# EAGLE schematic backpower_eeprom_rpibout (EAGLE 8.0.1)
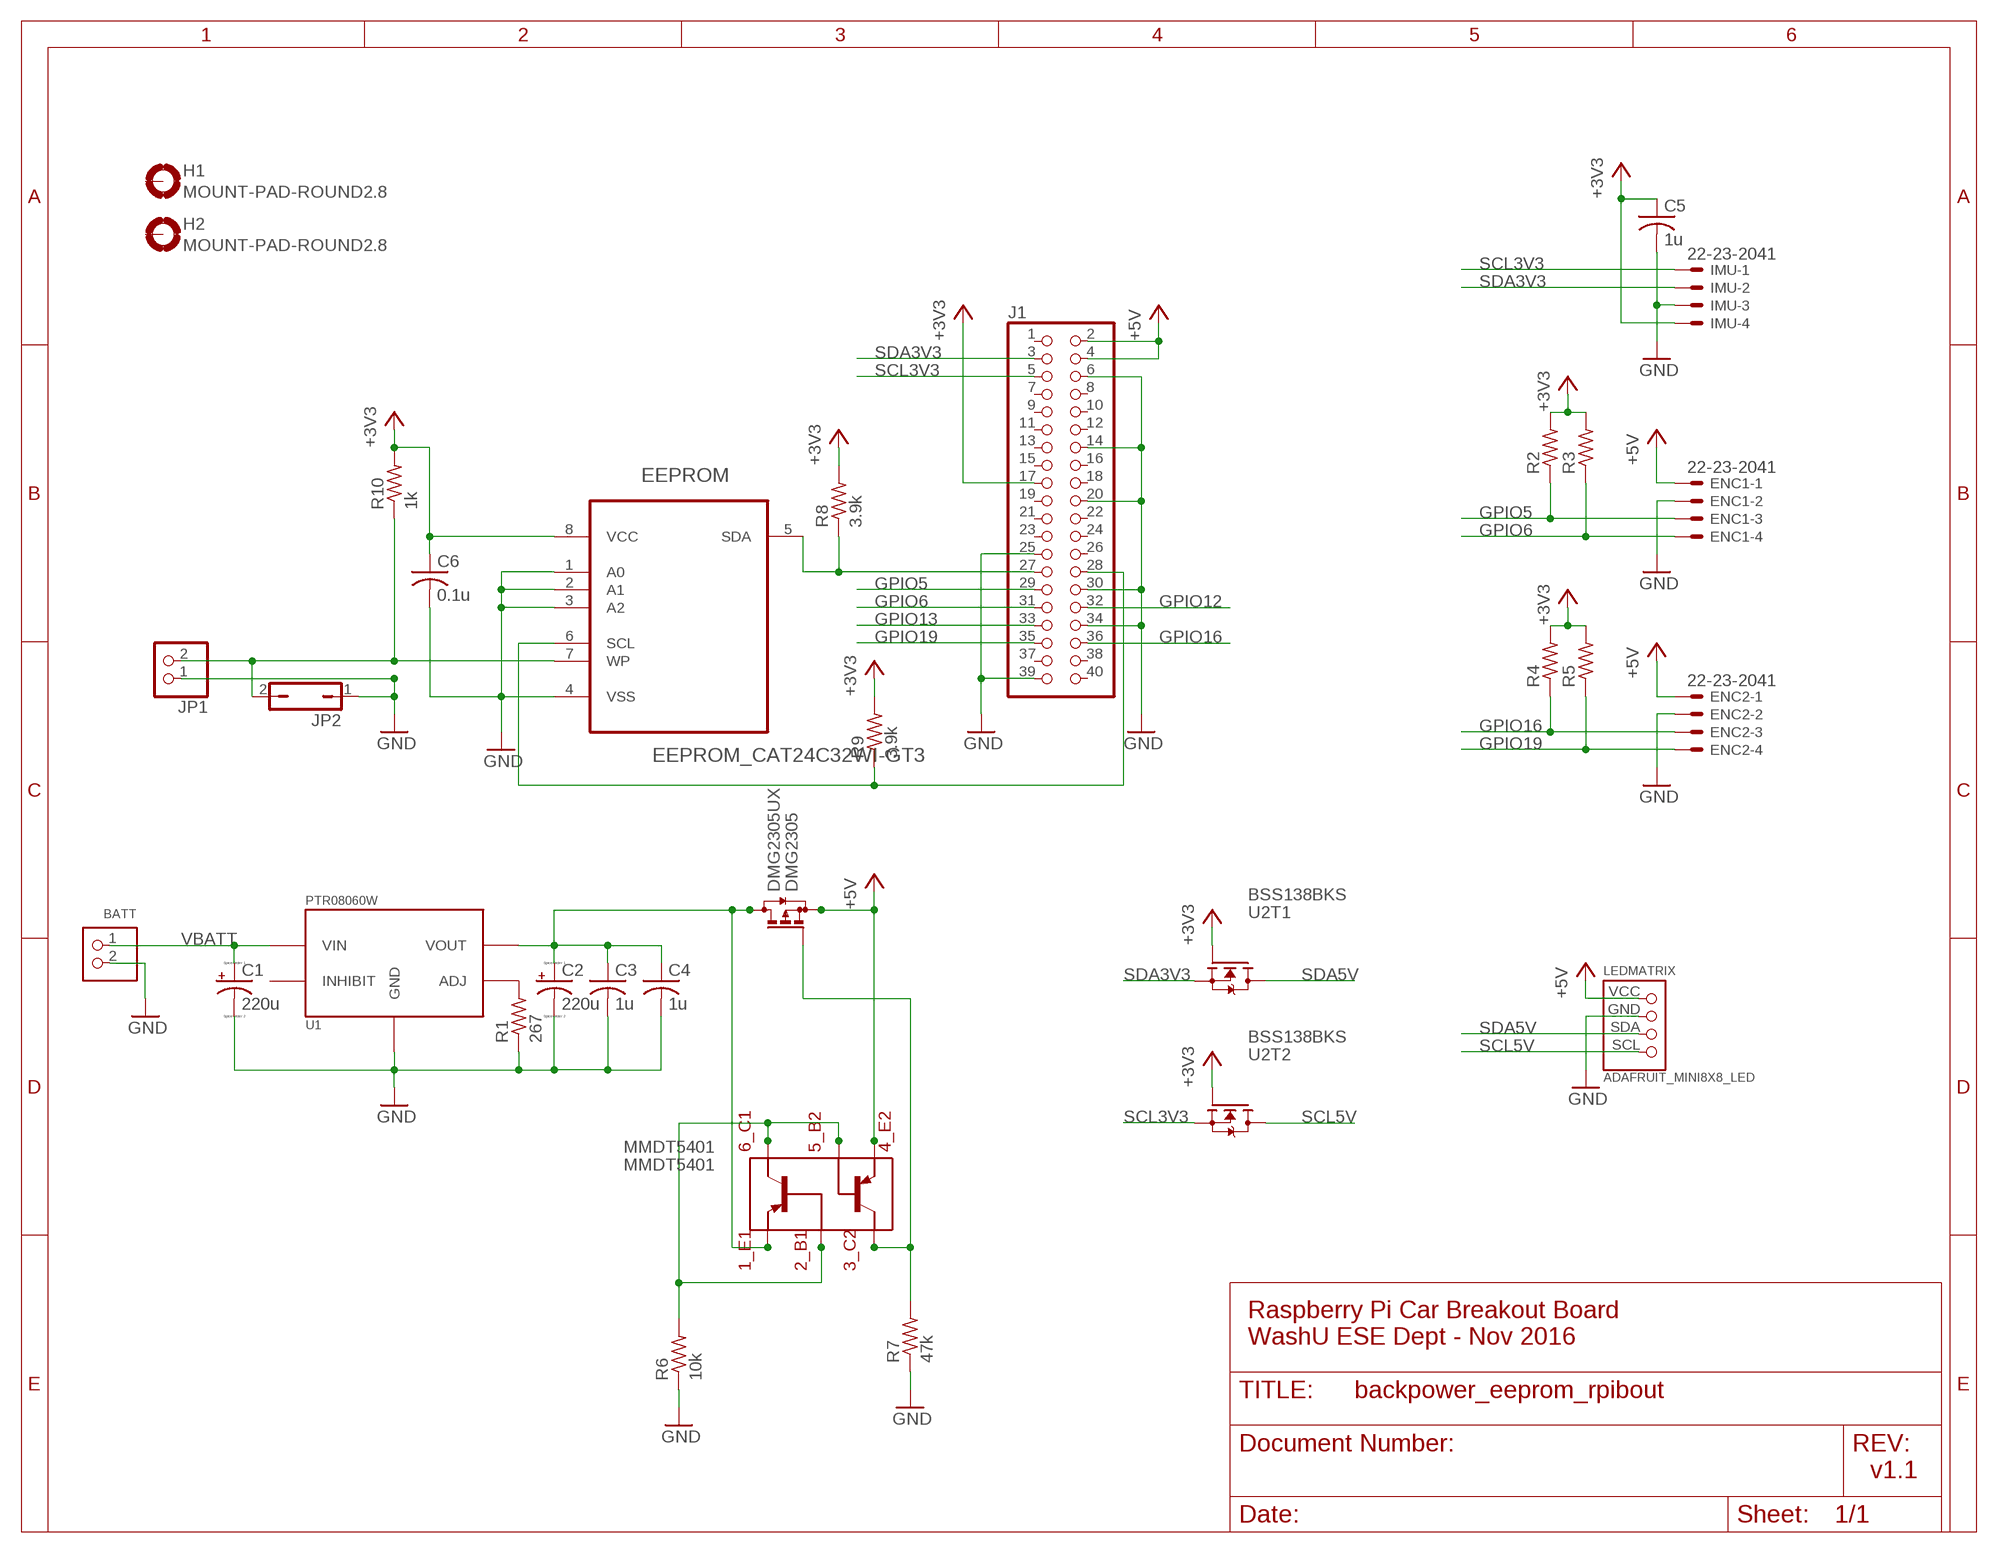
[diagram p0: schematic, sheet 1]

## Parts
BATT  ULTRAFIT_2CIRC  [ULTRAFIT_2CIRC_RANGLE]
C1  220u  CPOL-USE3.5-8  [E3,5-8]
C2  220u  CPOL-USE3.5-8  [E3,5-8]
C3  1u  C-USC1206  [C1206]
C4  1u  C-USC1206  [C1206]
C5  1u  C-USC1206  [C1206]
C6  0.1u  C-USC1206  [C1206]
DMG2305  DMG2305UX  [SOT23-3]
EEPROM  EEPROM_CAT24C32WI-GT3  [SOIC-8]
ENC1  22-23-2041  [22-23-2041]
ENC2  22-23-2041  [22-23-2041]
H1  MOUNT-PAD-ROUND2.8  [2,8-PAD]
H2  MOUNT-PAD-ROUND2.8  [2,8-PAD]
IMU  22-23-2041  [22-23-2041]
J1  PINHD-2X20  [2X20]
JP1  PINHD-1X2  [1X02]
JP2  JP1Q  [JP1]
LEDMATRIX  ADAFRUIT_MINI8X8_LED  [ADAFRUIT_MINI8X8_BACKPACK]
MMDT5401  MMDT5401  [SOT363]
R1  267  R-US_R1206  [R1206]
R2  R-US_R1206  [R1206]
R3  R-US_R1206  [R1206]
R4  R-US_R1206  [R1206]
R5  R-US_R1206  [R1206]
R6  10k  R-US_R1206  [R1206]
R7  47k  R-US_R1206  [R1206]
R8  3.9k  R-US_R1206  [R1206]
R9  3.9k  R-US_R1206  [R1206]
R10  1k  R-US_R1206  [R1206]
U1  PTR08060W  [EDP_MODULE]
U2  BSS138BKS  [SOT363]

## Nets
+3V3: C5.1 C6.1 EEPROM.8(VCC) IMU.4 J1.17 R2.2 R3.2 R4.2 R5.2 R8.2 R9.2 R10.2 U2.2(T1:G) U2.5(T2:G)
+5V: DMG2305.2(S) ENC1.1 ENC2.1 J1.2 J1.4 LEDMATRIX.VCC MMDT5401.1(E1)
GND: BATT.2 C1.- C2.- C3.2 C4.2 C5.2 C6.2 EEPROM.1(A0) EEPROM.2(A1) EEPROM.3(A2) EEPROM.4(VSS) ENC1.2 ENC2.2 IMU.3 J1.6 J1.14 J1.20 J1.25 J1.30 J1.34 J1.39 JP1.1 JP2.1 LEDMATRIX.GND R1.1 R6.1 R7.1 U1.P3(GND)
GPIO5: ENC1.3 J1.29 R2.1
GPIO6: ENC1.4 J1.31 R3.1
GPIO12: J1.32
GPIO13: J1.33
GPIO16: ENC2.3 J1.36 R4.1
GPIO19: ENC2.4 J1.35 R5.1
N$1: MMDT5401.2(B1) MMDT5401.3(C2) MMDT5401.5(B2) R6.2
N$2: R1.2 U1.P5(ADJ)
N$3: DMG2305.1(G) MMDT5401.6(C1) R7.2
N$5: EEPROM.5(SDA) J1.27 R8.1
N$7: EEPROM.6(SCL) J1.28 R9.1
N$9: EEPROM.7(WP) JP1.2 JP2.2 R10.1
SCL3V3: IMU.1 J1.5 U2.4(T2:S)
SCL5V: LEDMATRIX.SCL U2.3(T2:D)
SDA3V3: IMU.2 J1.3 U2.1(T1:S)
SDA5V: LEDMATRIX.SDA U2.6(T1:D)
VBATT: BATT.1 C1.+ U1.P2(VIN)
VOUT: C2.+ C3.1 C4.1 DMG2305.3(D) MMDT5401.4(E2) U1.P4(VOUT)
Unconnected: H1.B2,8(MOUNT) H2.B2,8(MOUNT) J1.1 J1.7 J1.8 J1.9 J1.10 J1.11 J1.12 J1.13 J1.15 J1.16 J1.18 J1.19 J1.21 J1.22 J1.23 J1.24 J1.26 J1.37 J1.38 J1.40 U1.P1(INHIBIT)

## Notes on the sheet
- Raspberry Pi Car Breakout Board
  WashU ESE Dept - Nov 2016
- v1.1

## Library data of the parts
BATT = rpibout:ULTRAFIT_2CIRC: Molex Ultra-Fit Right Angle Header, 3.50mm Pitch, Single Row, 2 Circuits
C1 C2 = resistor:CPOL-US: POLARIZED CAPACITOR, American symbol
C3-C6 = resistor:C-US: CAPACITOR, American symbol
DMG2305 = rpibout:DMG2305UX: DMG2305 https://www.diodes.com/assets/Datasheets/DMG2305UX.pdf
EEPROM = rpibout:EEPROM_CAT24C32WI-GT3: CAT24C32WI-GT3 SOIC8 http://www.onsemi.cn/PowerSolutions/document/CAT24C32-D.PDF
ENC1 ENC2 IMU = con-molex:22-23-2041: .100" (2.54mm) Center Header - 4 Pin; MF: MOLEX; MPN: 22-23-2041; OC_FARNELL: 1462920; OC_NEWARK: 38C0355
H1 H2 = holes:MOUNT-PAD-ROUND: MOUNTING PAD, round
J1 = pinhead:PINHD-2X20: PIN HEADER
JP1 = pinhead:PINHD-1X2: PIN HEADER
JP2 = jumper:JP1Q: JUMPER
LEDMATRIX = rpibout:ADAFRUIT_MINI8X8_LED: Adafruit Mini 8x8 LED Matrix Backpack
MMDT5401 = rpibout:MMDT5401: 150V DUAL PNP SMALL SIGNAL TRANSISTOR IN SOT363
R1-R10 = resistor:R-US_: RESISTOR, American symbol
U1 = rpibout:PTR08060W: PTR08060W Texas Instruments Buck Power Module
U2 = rpibout:BSS138BKS: BSS138BKS Dual N-MOSFET